# EAGLE schematic Full-LocoNet-Interface (EAGLE 7.7.0)
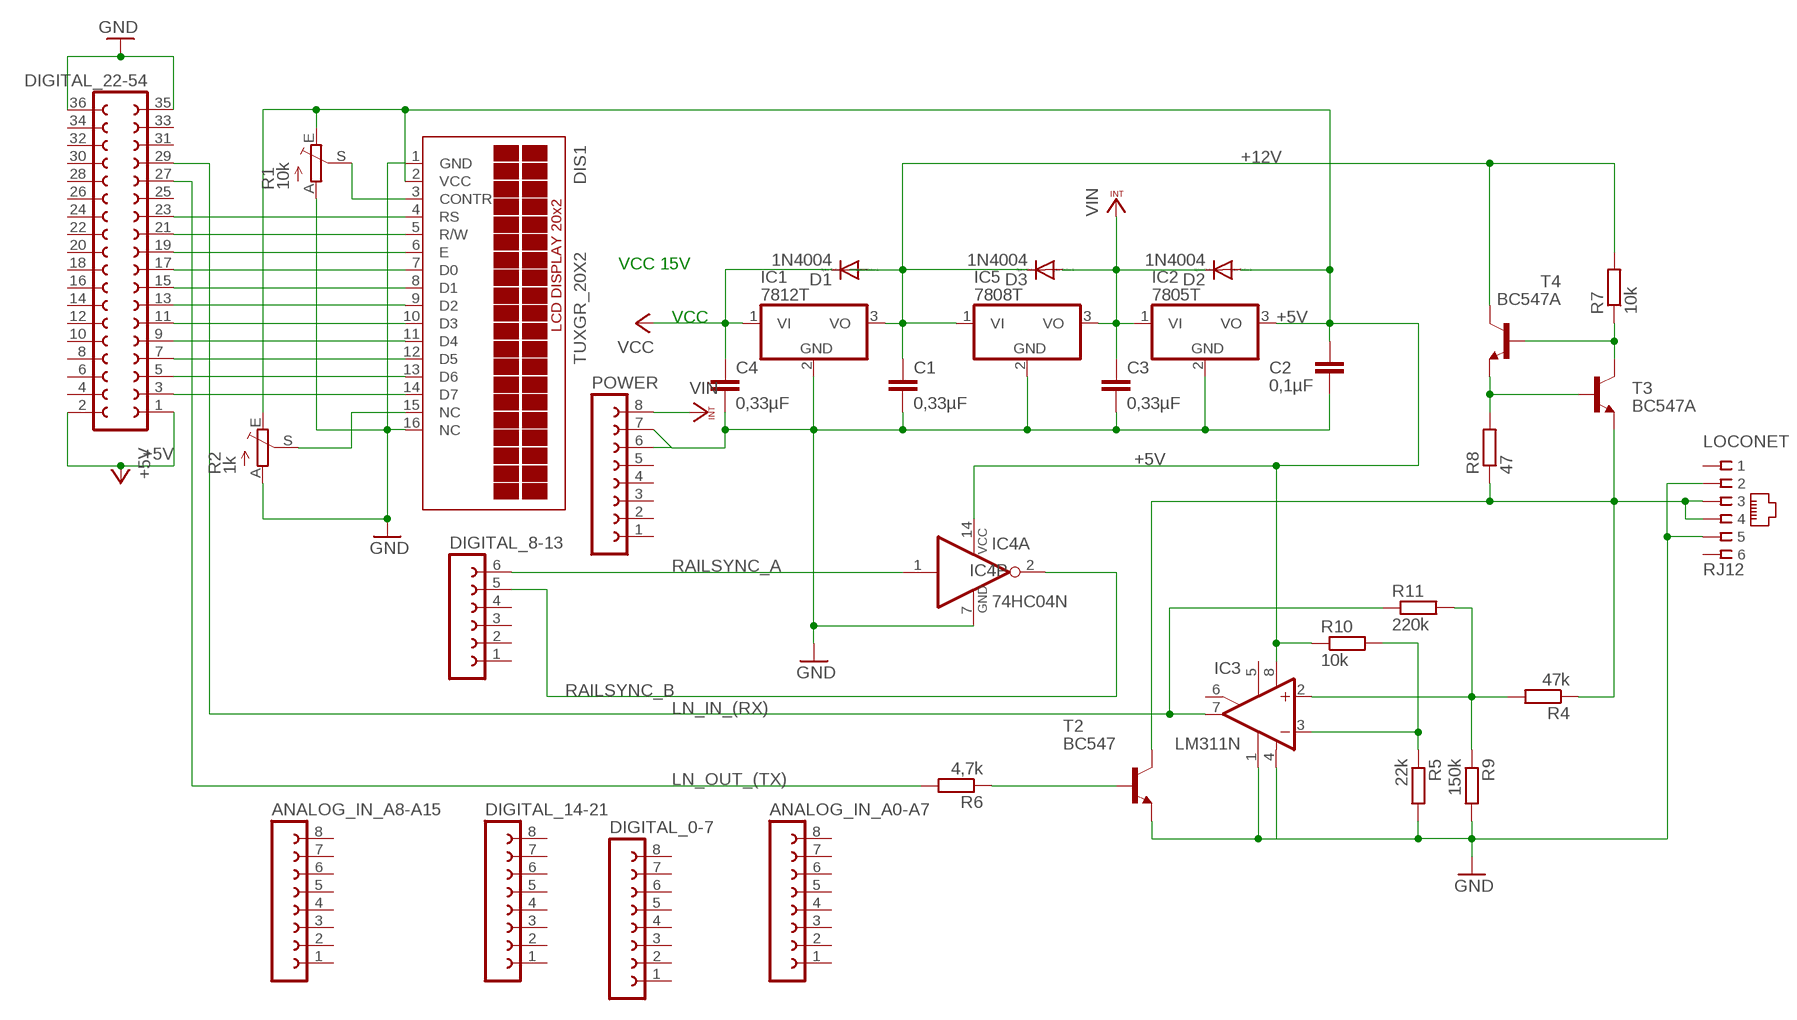
[diagram p0: schematic, sheet 1]

## Parts
ANALOG_IN_A0-A7  FE08-1  [FE08]
ANALOG_IN_A8-A15  FE08-1  [FE08]
C1  0,33µF  C-EU050-025X075  [C050-025X075]
C2  0,1µF  C-EU050-025X075  [C050-025X075]
C3  0,33µF  C-EU050-025X075  [C050-025X075]
C4  0,33µF  C-EU050-045X075  [C050-045X075]
D1  1N4004  [DO41-10]
D2  1N4004  [DO41-10]
D3  1N4004  [DO41-10]
DIGITAL_0-7  FE08-1  [FE08]
DIGITAL_8-13  FE06-1  [FE06]
DIGITAL_14-21  FE08-1  [FE08]
DIGITAL_22-54  FE18-2  [FE18-2]
DIS1  TUXGR_20X2  [TUXGR_20X2]
IC1  7812T  [TO220H]
IC2  7805T  [TO220H]
IC3  LM311N  [DIL08]
IC4  74HC04N  [DIL14]
IC5  7808T  [TO220H]
LOCONET  RJ12  RJ11-6L-B  [RJ11-NO_SHIELD]
POWER  FE08-1  [FE08]
R1  10k  TRIM_EU-B90P  [SP19L]
R2  1k  TRIM_EU-B90P  [SP19L]
R4  47k  R-EU_0204/7  [0204/7]
R5  22k  R-EU_0204/7  [0204/7]
R6  4,7k  R-EU_0204/7  [0204/7]
R7  10k  R-EU_0204/7  [0204/7]
R8  47  R-EU_0204/7  [0204/7]
R9  150k  R-EU_0204/7  [0204/7]
R10  10k  R-EU_0204/7  [0204/7]
R11  220k  R-EU_0204/7  [0204/7]
T2  BC547  [TO92]
T3  BC547A  BC547  [TO92]
T4  BC547A  BC547  [TO92]

## Nets
+5V: C2.1 D2.A DIGITAL_22-54.1 DIGITAL_22-54.2 DIS1.2(VCC) IC2.3(VO) IC3.8(V+) IC4.14(P:VCC) R1.E R2.E R10.1
+12V: C1.1 D3.C IC1.3(VO) IC5.1(VI) R7.2 T4.3(C)
GND: C1.2 C2.2 C3.2 C4.2 DIGITAL_22-54.35 DIGITAL_22-54.36 DIS1.1(GND) DIS1.16(NC) IC1.2(GND) IC2.2(GND) IC3.1(GND) IC3.4(V-) IC4.7(P:GND) IC5.2(GND) LOCONET.2 LOCONET.5 POWER.6 POWER.7 R1.A R2.A R5.2 R9.2 T2.1(E)
LN_IN_(RX): DIGITAL_22-54.29 IC3.7(OUT) R11.1
LN_OUT_(TX): DIGITAL_22-54.27 R6.2
N$1: DIGITAL_22-54.7 DIS1.12(D5)
N$2: DIGITAL_22-54.23 DIS1.4(RS)
N$3: R7.1 T3.3(C) T4.2(B)
N$4: DIGITAL_22-54.21 DIS1.5(R/W)
N$5: DIGITAL_22-54.19 DIS1.6(E)
N$6: R8.2 T3.2(B) T4.1(E)
N$7: IC3.2(+IN) R4.2 R9.1 R11.2
N$8: R6.1 T2.2(B)
N$9: LOCONET.3 LOCONET.4 R4.1 R8.1 T2.3(C) T3.1(E)
N$10: DIGITAL_22-54.17 DIS1.7(D0)
N$11: DIGITAL_22-54.15 DIS1.8(D1)
N$12: DIGITAL_22-54.13 DIS1.9(D2)
N$13: DIGITAL_22-54.11 DIS1.10(D3)
N$14: DIGITAL_22-54.9 DIS1.11(D4)
N$15: DIGITAL_22-54.5 DIS1.13(D6)
N$16: IC3.3(-IN) R5.1 R10.2
N$17: DIGITAL_22-54.3 DIS1.14(D7)
N$20: DIS1.3(CONTR) R1.S
N$21: DIS1.15(NC) R2.S
RAILSYNC_A: DIGITAL_8-13.6 IC4.1(A:I)
RAILSYNC_B: DIGITAL_8-13.5 IC4.2(A:O)
VCC: C4.1 D1.C IC1.1(VI)
VCCINT: C3.1 D2.C D3.A IC2.1(VI) IC5.3(VO) POWER.8 ; supply symbol labelled VIN
Unconnected: ANALOG_IN_A0-A7.1 ANALOG_IN_A0-A7.2 ANALOG_IN_A0-A7.3 ANALOG_IN_A0-A7.4 ANALOG_IN_A0-A7.5 ANALOG_IN_A0-A7.6 ANALOG_IN_A0-A7.7 ANALOG_IN_A0-A7.8 ANALOG_IN_A8-A15.1 ANALOG_IN_A8-A15.2 ANALOG_IN_A8-A15.3 ANALOG_IN_A8-A15.4 ANALOG_IN_A8-A15.5 ANALOG_IN_A8-A15.6 ANALOG_IN_A8-A15.7 ANALOG_IN_A8-A15.8 D1.A DIGITAL_0-7.1 DIGITAL_0-7.2 DIGITAL_0-7.3 DIGITAL_0-7.4 DIGITAL_0-7.5 DIGITAL_0-7.6 DIGITAL_0-7.7 DIGITAL_0-7.8 DIGITAL_8-13.1 DIGITAL_8-13.2 DIGITAL_8-13.3 DIGITAL_8-13.4 DIGITAL_14-21.1 DIGITAL_14-21.2 DIGITAL_14-21.3 DIGITAL_14-21.4 DIGITAL_14-21.5 DIGITAL_14-21.6 DIGITAL_14-21.7 DIGITAL_14-21.8 DIGITAL_22-54.4 DIGITAL_22-54.6 DIGITAL_22-54.8 DIGITAL_22-54.10 DIGITAL_22-54.12 DIGITAL_22-54.14 DIGITAL_22-54.16 DIGITAL_22-54.18 DIGITAL_22-54.20 DIGITAL_22-54.22 DIGITAL_22-54.24 DIGITAL_22-54.25 DIGITAL_22-54.26 DIGITAL_22-54.28 DIGITAL_22-54.30 DIGITAL_22-54.31 DIGITAL_22-54.32 DIGITAL_22-54.33 DIGITAL_22-54.34 IC3.5(ON) IC3.6(ON/STR) IC4.3(B:I) IC4.4(B:O) IC4.5(C:I) IC4.6(C:O) IC4.8(D:O) IC4.9(D:I) IC4.10(E:O) IC4.11(E:I) IC4.12(F:O) IC4.13(F:I) LOCONET.1 LOCONET.6 POWER.1 POWER.2 POWER.3 POWER.4 POWER.5

## Notes on the sheet
- VCC 15V

## Library data of the parts
ANALOG_IN_A0-A7 ANALOG_IN_A8-A15 DIGITAL_0-7 DIGITAL_14-21 POWER = con-lsta:FE08-1: FEMALE HEADER; OC_FARNELL: unknown; OC_NEWARK: unknown
C1-C4 = rcl:C-EU: CAPACITOR, European symbol
D1-D3 = diode:1N4004: DIODE general purpose rectifier, 1 A
DIGITAL_8-13 = con-lsta:FE06-1: FEMALE HEADER; OC_FARNELL: unknown; OC_NEWARK: unknown
DIGITAL_22-54 = con-lsta:FE18-2: FEMALE HEADER; OC_FARNELL: unknown; OC_NEWARK: unknown
DIS1 = display-lcd:TUXGR_20X2: Tuxgraphics LCD display 20x2 characters reflective, without background light Source: tuxgr_20x2.pdf; OC_FARNELL: unknown; OC_NEWARK: unknown
IC1 IC2 IC5 = linear:78*: Positive VOLTAGE REGULATOR Source: http://cache.national.com/ds/LM/LM78L05.pdf http://www.fairchildsemi.com/ds/LM/LM7805.pdf
IC3 = linear:LM311: COMPARATOR
IC4 = 74xx-eu:74*04: Hex INVERTER
LOCONET = con-tycoelectronics:RJ11: CORCOM Modular RJ Jacks No Shield Source: www.tycoelectronics.com .. ENG_DS_1654001_1099_RJ_L_0507.pdf; MF: TYCO ELECTRONICS; MPN: RJ11-6L-B; OC_FARNELL: unknown; OC_NEWARK: 52K3613
R1 R2 = pot:TRIM_EU-: POTENTIOMETER
R4-R11 = rcl:R-EU_: RESISTOR, European symbol
T2-T4 = transistor-neu-to92:BC547: NPN TRANSISTOR